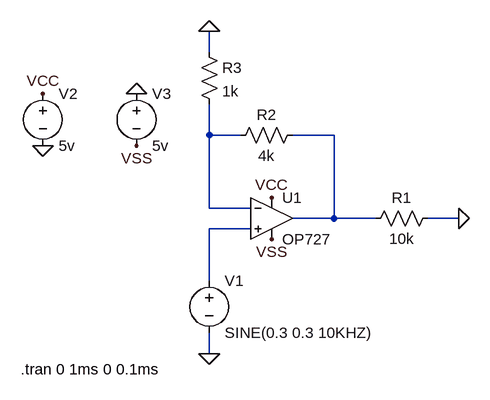
[diagram p0: schematic 6432085221-PB3.asc]
6432085221-PB3.asc, the LTspice schematic file:
Version 4
SHEET 1 1124 680
WIRE 720 160 720 128
WIRE 720 288 720 240
WIRE 768 288 720 288
WIRE 912 288 848 288
WIRE 720 400 720 288
WIRE 784 400 720 400
WIRE 912 416 912 288
WIRE 912 416 848 416
WIRE 976 416 912 416
WIRE 1104 416 1056 416
WIRE 784 432 720 432
WIRE 720 512 720 432
WIRE 720 624 720 592
FLAG 464 304 0
FLAG 608 224 0
FLAG 720 624 0
FLAG 816 384 VCC
FLAG 464 224 VCC
FLAG 816 448 VSS
FLAG 608 304 VSS
FLAG 720 128 0
FLAG 1104 416 0
SYMBOL voltage 720 496 R0
WINDOW 123 0 0 Left 0
WINDOW 39 0 0 Left 0
SYMATTR InstName V1
SYMATTR Value SINE(0.3 0.3 10KHZ)
SYMBOL voltage 464 208 R0
WINDOW 123 0 0 Left 0
WINDOW 39 0 0 Left 0
SYMATTR InstName V2
SYMATTR Value 5v
SYMBOL voltage 608 208 R0
WINDOW 123 0 0 Left 0
WINDOW 39 0 0 Left 0
SYMATTR InstName V3
SYMATTR Value 5v
SYMBOL res 864 272 R90
WINDOW 0 0 56 VBottom 2
WINDOW 3 32 56 VTop 2
SYMATTR InstName R2
SYMATTR Value 4k
SYMBOL res 704 144 R0
SYMATTR InstName R3
SYMATTR Value 1k
SYMBOL OpAmps\\OP727 816 352 R0
SYMATTR InstName U1
SYMBOL res 1072 400 R90
WINDOW 0 0 56 VBottom 2
WINDOW 3 32 56 VTop 2
SYMATTR InstName R1
SYMATTR Value 10k
TEXT 430 648 Left 2 !.tran 0 1ms 0 0.1ms

The netlist it stands for:
* 6432085221-PB3.asc
V1 N003 0 SINE(0.3 0.3 10KHZ)
V2 VCC 0 5v
V3 0 VSS 5v
R2 N002 N001 4k
R3 0 N001 1k
XU1 N003 N001 VCC VSS N002 OP727  ; pins In+ In- V+ V- OUT
R1 0 N002 10k
.tran 0 1ms 0 0.1ms
.backanno
.end